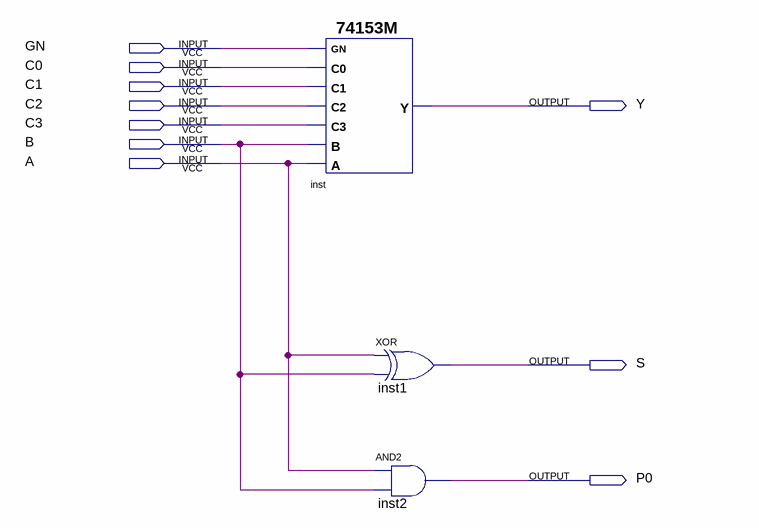
[diagram p0: schematic sheet]
// Quartus schematic cmb4.bdf as structural Verilog: 3 symbols, 10 pins
module cmb4 (
  input  GN,
  input  C0,
  input  C1,
  input  C2,
  input  C3,
  input  B,
  input  A,
  output Y,
  output S,
  output P0
);

  \74153M  inst (.A(A), .B(B), .C3(C3), .C2(C2), .C1(C1), .C0(C0), .GN(GN), .Y(Y));
  xor inst1 (S, A, B);
  and inst2 (P0, A, B);
endmodule
